# EasyEDA schematic cnc3018_ctrl.json
TITLE: Sheet_1; REV: 1.0; Date: 2023-10-21; Sheet: 1/1; Company: Your Company
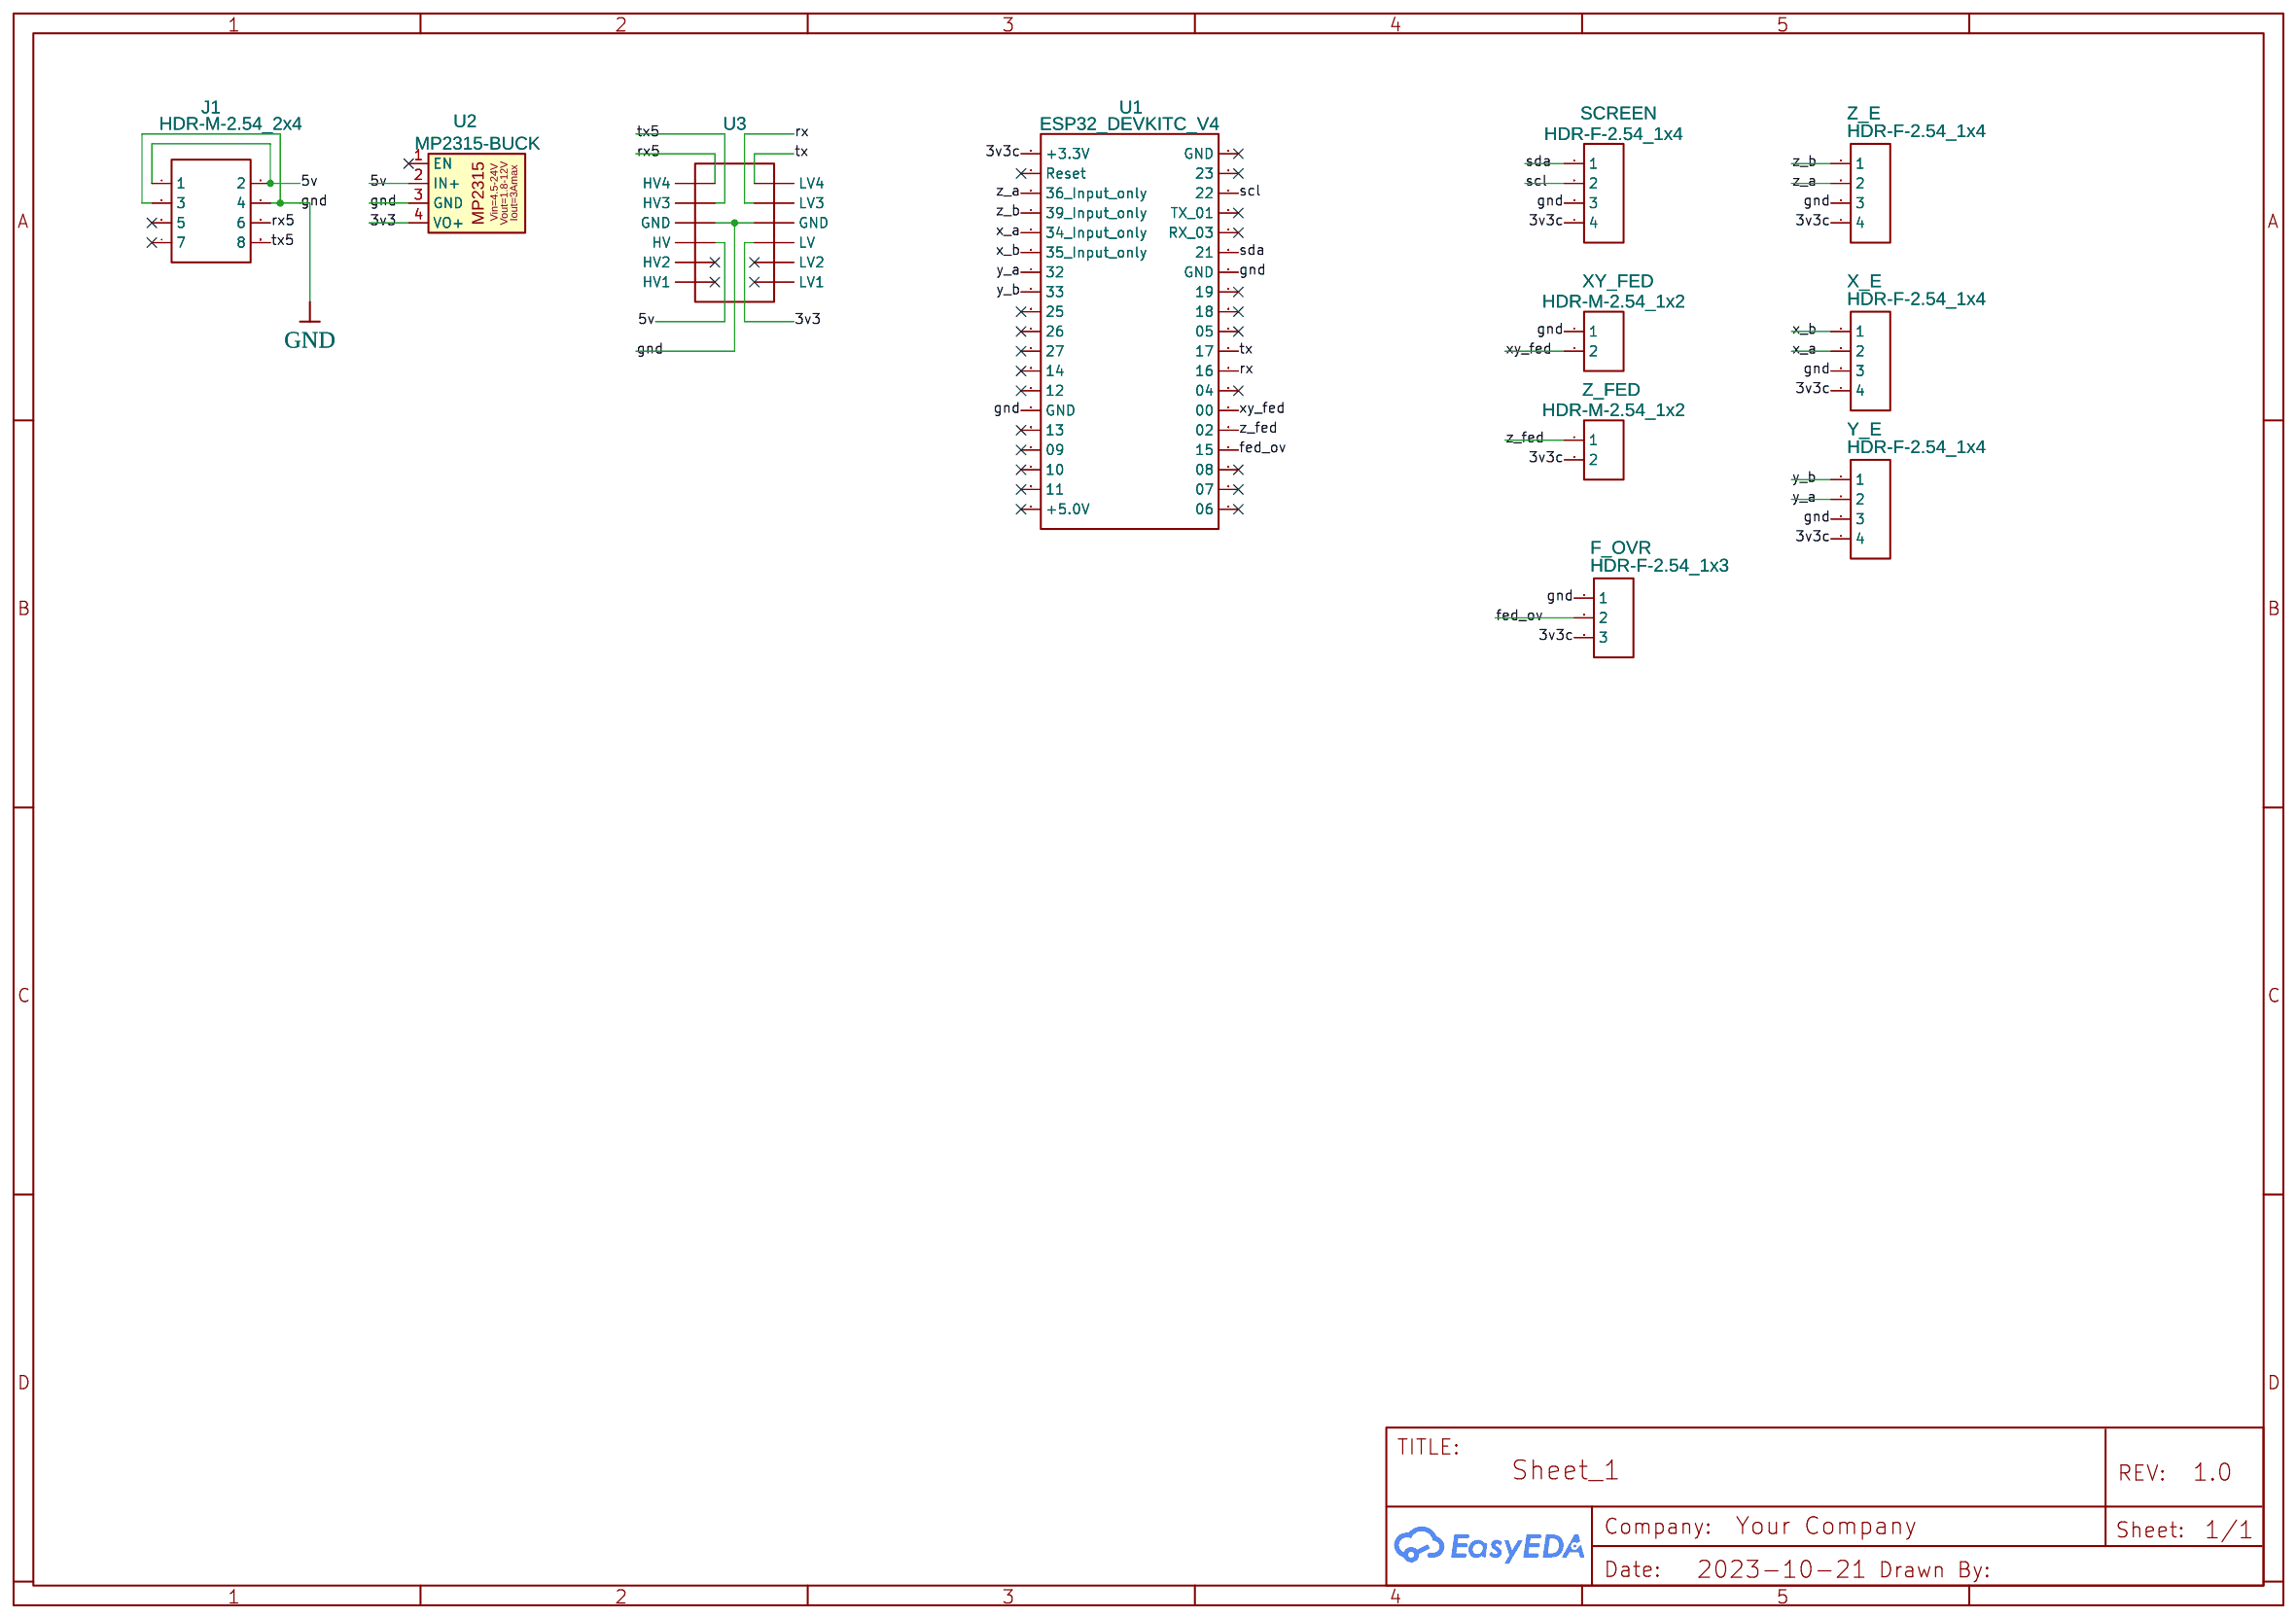
[diagram p0: schematic sheet]

## Parts
F_OVR  HDR-F-2.54_1x3  [HDR-F-2.54_1X3]
J1  HDR-M-2.54_2x4  [HDR-M-2.54_2X4]
SCREEN  HDR-F-2.54_1x4  [HDR-F-2.54_1X4]
U1  ESP32_DEVKITC_V4  [ESP32-DEVKITC CORE BOARD ESP32]
U2  MP2315-BUCK  [MP2315-MODULE2_ZA]
U3  NO  [LEVEL-CONVERTER]
X_E  HDR-F-2.54_1x4  [HDR-F-2.54_1X4]
XY_FED  HDR-M-2.54_1x2  [HDR-M-2.54_1X2]
Y_E  HDR-F-2.54_1x4  [HDR-F-2.54_1X4]
Z_E  HDR-F-2.54_1x4  [HDR-F-2.54_1X4]
Z_FED  HDR-M-2.54_1x2  [HDR-M-2.54_1X2]

## Library data of the parts
F_OVR = HDR-F-2.54_1x3: Supplier Part: C146690; Supplier: LCSC; Contributor: LCEDA_Lib
J1 = HDR-M-2.54_2x4: Supplier Part: C58363; Supplier: LCSC; Contributor: LCEDA_Lib
SCREEN X_E Y_E Z_E = HDR-F-2.54_1x4: Supplier Part: C225501; Supplier: LCSC; Contributor: LCEDA_Lib
U1 = ESP32_DEVKITC_V4: Supplier Part: A5130; link: https://www.allnewstep.com/product/5253/%E0%B8%9A%E0%B8%AD%E0%B8%A3%E0%B9%8C%E0%B8%94-esp32-devkitc-core-board-esp32-v4-development-board-esp32-wroom-32u; Contributor: petch.elec14
U2 = MP2315-BUCK: Supplier: FatimaTech; Contributor: zainul.aabdin
U3 = LEVEL-CONVERTER: Contributor: Manuelito
XY_FED Z_FED = HDR-M-2.54_1x2: Supplier Part: C124375; Supplier: LCSC; Contributor: LCEDA_Lib

## Nets
3v3: U2.4(VO+) U3.3(LV)
3v3c: F_OVR.3 SCREEN.4 U1.1(+3.3V) X_E.4 Y_E.4 Z_E.4 Z_FED.2
5v: J1.1 J1.2 U2.2(IN+) U3.10(HV)
GND: F_OVR.1 J1.3 J1.4 SCREEN.3 U1.14(GND) U1.32(GND) U2.3(GND) U3.4(GND) U3.9(GND) X_E.3 XY_FED.1 Y_E.3 Z_E.3
fed_ov: F_OVR.2 U1.23(15)
rx: U1.27(16) U3.5(LV3)
rx5: J1.6 U3.7(HV4)
scl: SCREEN.2 U1.36(22)
sda: SCREEN.1 U1.33(21)
tx: U1.28(17) U3.6(LV4)
tx5: J1.8 U3.8(HV3)
x_a: U1.5(34 Input only) X_E.2
x_b: U1.6(35 Input only) X_E.1
xy_fed: U1.25(00) XY_FED.2
y_a: U1.7(32) Y_E.2
y_b: U1.8(33) Y_E.1
z_a: U1.3(36 Input only) Z_E.2
z_b: U1.4(39 Input only) Z_E.1
z_fed: U1.24(02) Z_FED.1

Not connected (* = marked no-connect by the designer): J1 5* 7*; U1 2(Reset)* 9(25)* 10(26)* 11(27)* 12(14)* 13(12)* 15(13)* 16(09)* 17(10)* 18(11)* 19(+5.0V)* 20(06)* 21(07)* 22(08)* 26(04)* 29(05)* 30(18)* 31(19)* 34(RX 03)* 35(TX 01)* 37(23)* 38(GND)*; U2 1(EN)*; U3 1(LV1)* 2(LV2)* 11(HV2)* 12(HV1)*
